# EAGLE design Termrf_v3 (EAGLE 5.11)
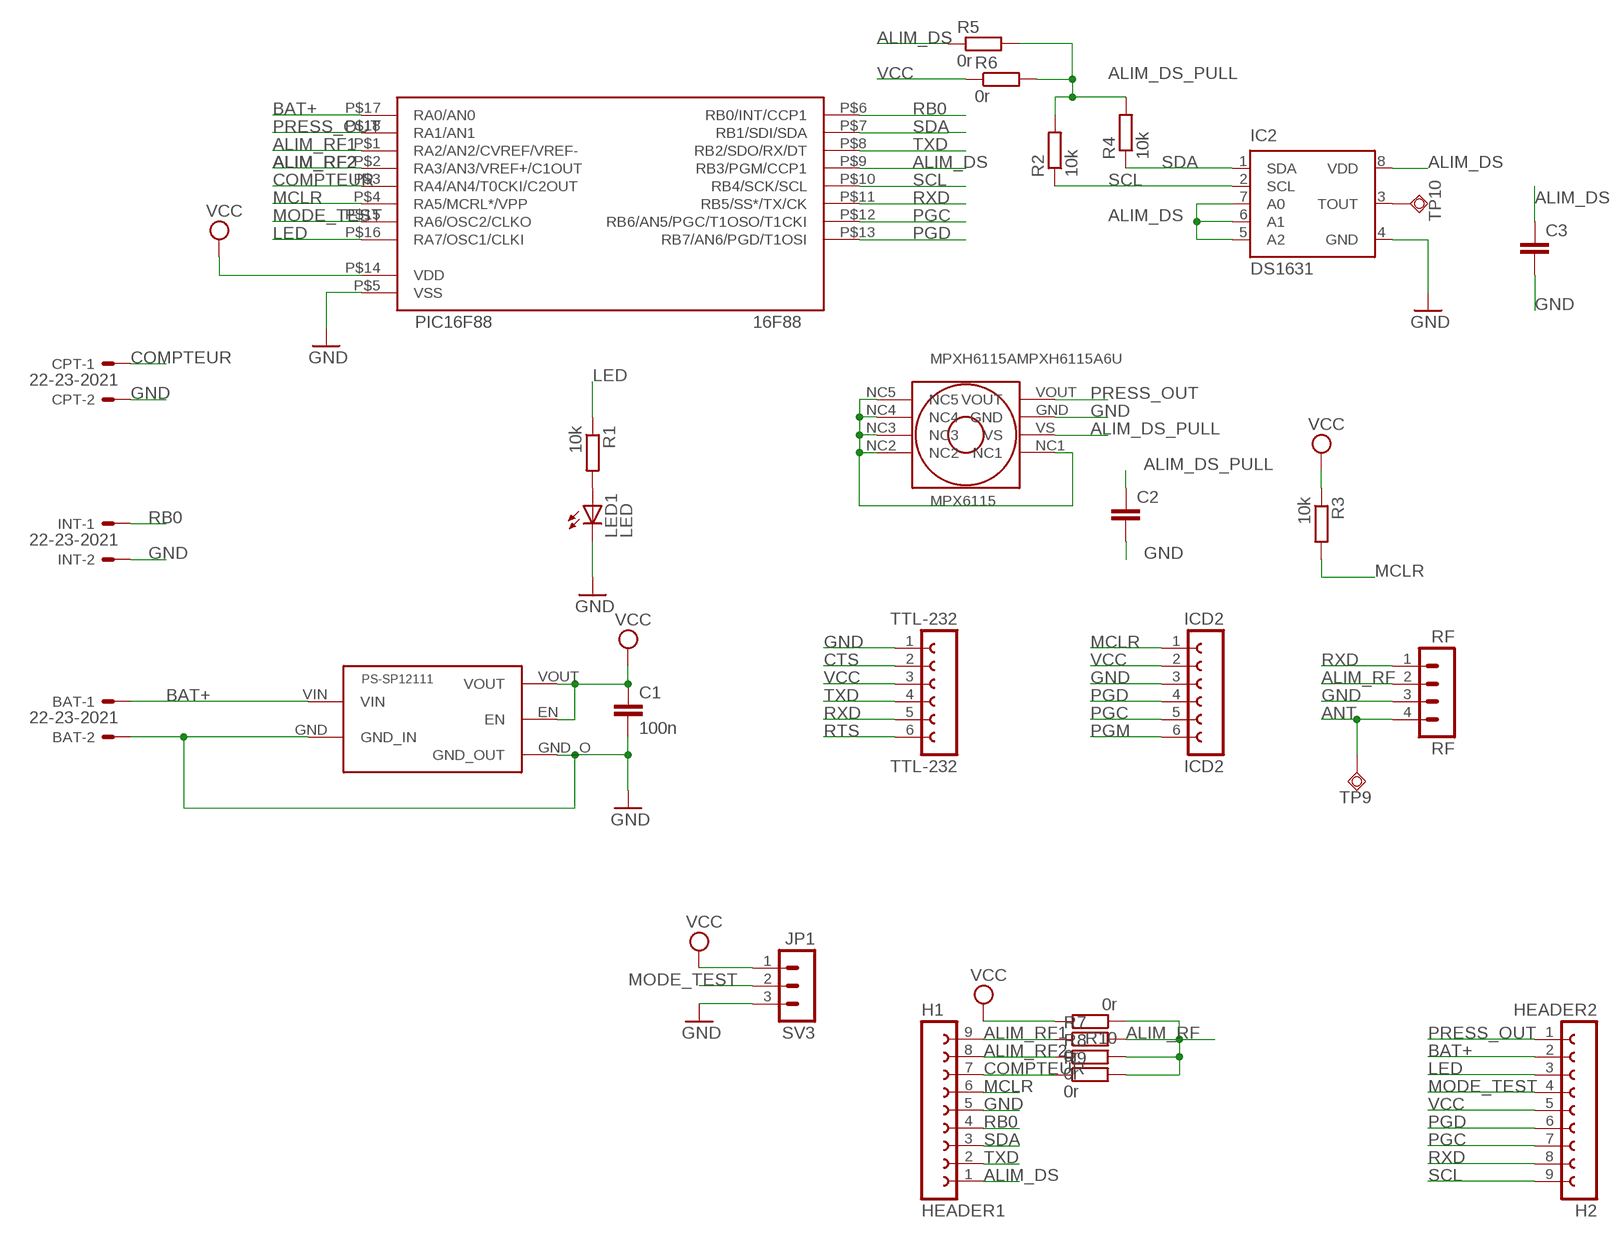
[diagram p0: schematic, sheet 1]

## Parts
16F88  PIC16F88  PIC16F88-18-SOIC  [SOIC18]
BAT  22-23-2021  [22-23-2021]
C1  100n  C-EUC0805  [C0805]
C2  C-EUC0805  [C0805]
C3  C-EUC0805  [C0805]
CPT  22-23-2021  [22-23-2021]
H1  HEADER1  FE09-1  [FE09]
H2  HEADER2  FE09-1  [FE09]
IC2  DS1631  DS1621VT  [SO08-208]
ICD2  ICD2  FE06-1  [FE06]
INT  22-23-2021  [22-23-2021]
LED1  LED  LED3MM  [LED3MM]
MPX6115  MPXH6115AMPXH6115A6U  [MPXH6115A]
R1  10k  R-EU_M0805  [M0805]
R2  10k  R-EU_M0805  [M0805]
R3  10k  R-EU_M0805  [M0805]
R4  10k  R-EU_M0805  [M0805]
R5  0r  R-EU_M0805  [M0805]
R6  0r  R-EU_M0805  [M0805]
R7  0r  R-EU_M0805  [M0805]
R8  0r  R-EU_M0805  [M0805]
R9  0r  R-EU_M0805  [M0805]
R10  0r  R-EU_M0805  [M0805]
RF  RF  MA04-1  [MA04-1]
SV3  JP1  MA03-1  [MA03-1]
TP9  TPSQPAD1-13  [P1-13]
TP10  TPSQPAD1-13  [P1-13]
TTL-232  TTL-232  FE06-1  [FE06]
U$1  PS-SP12111-BOTTOM  [PS-SP12111-BOTTOM]

## Nets
ALIM_DS: 16F88.P$9(RB3/PGM/CCP1) C3.1 H1.1 IC2.5(A2) IC2.6(A1) IC2.7(A0) IC2.8(VDD) R5.1
ALIM_DS_PULL: C2.1 MPX6115.VS R2.2 R4.2 R5.2 R6.2
ALIM_RF: R7.2 R8.2 R9.2 R10.1 RF.2
ALIM_RF1: 16F88.P$1(RA2/AN2/CVREF/VREF-) H1.9 R7.1
ALIM_RF2: 16F88.P$2(RA3/AN3/VREF+/C1OUT) H1.8 R8.1
ANT: RF.4 TP9.TP
BAT+: 16F88.P$17(RA0/AN0) BAT.1 H2.2 U$1.VIN
COMPTEUR: 16F88.P$3(RA4/AN4/T0CKI/C2OUT) CPT.1 H1.7 R9.1
CTS: TTL-232.2
GND: 16F88.P$5(VSS) BAT.2 C1.2 C2.2 C3.2 CPT.2 H1.5 IC2.4(GND) ICD2.3 INT.2 LED1.K(C) MPX6115.GND RF.3 SV3.3 TTL-232.1 U$1.GND(GND_IN) U$1.GND_O(GND_OUT)
LED: 16F88.P$16(RA7/OSC1/CLKI) H2.3 R1.1
MCLR: 16F88.P$4(RA5/MCRL*/VPP) H1.6 ICD2.1 R3.2
MODE_TEST: 16F88.P$15(RA6/OSC2/CLKO) H2.4 SV3.2
N$1: LED1.A R1.2
N$5: IC2.3(TOUT) TP10.TP
N$7: MPX6115.NC1 MPX6115.NC2 MPX6115.NC3 MPX6115.NC4 MPX6115.NC5
PGC: 16F88.P$12(RB6/AN5/PGC/T1OSO/T1CKI) H2.7 ICD2.5
PGD: 16F88.P$13(RB7/AN6/PGD/T1OSI) H2.6 ICD2.4
PGM: ICD2.6
PRESS_OUT: 16F88.P$18(RA1/AN1) H2.1 MPX6115.VOUT
RB0: 16F88.P$6(RB0/INT/CCP1) H1.4 INT.1
RTS: TTL-232.6
RXD: 16F88.P$11(RB5/SS*/TX/CK) H2.8 RF.1 TTL-232.5
SCL: 16F88.P$10(RB4/SCK/SCL) H2.9 IC2.2(SCL) R2.1
SDA: 16F88.P$7(RB1/SDI/SDA) H1.3 IC2.1(SDA) R4.1
TXD: 16F88.P$8(RB2/SDO/RX/DT) H1.2 TTL-232.4
VCC: 16F88.P$14(VDD) C1.1 H2.5 ICD2.2 R3.1 R6.1 R10.2 SV3.1 TTL-232.3 U$1.EN U$1.VOUT

## Library data of the parts
16F88 = pic16f88-v0.1:PIC16F88
BAT CPT INT = con-molex:22-23-2021: .100" (2.54mm) Center Header - 2 Pin
C1-C3 = resistor:C-EU: CAPACITOR, European symbol
H1 H2 = con-lsta:FE09-1: FEMALE HEADER
IC2 = maxim:DS1621: Digital Thermometer and Thermostat Source: http://pdfserv.maxim-ic.com/en/ds/DS1621.pdf
ICD2 TTL-232 = con-lsta:FE06-1: FEMALE HEADER
LED1 = led:LED: LED OSRAM: - CHIPLED LG R971, LG N971, LY N971, LG Q971, LY Q971, LO R971, LY R971 LH N974, LH R974 LS Q976, LO Q976, LY Q976 LO Q996 - Hyper CHIPLED LW Q18S LB Q993, LB Q99A, LB R99A - SideLED LS A670, LO A670, LY A670, LG A670, LP A670 LB A673, LV A673, LT A673, LW A673 LH A674 LY A675 LS A676, LA A676, LO A676, LY A676, LW A676 LS A679, LY A679, LG A679 - Hyper Micro SIDELED® LS Y876, LA Y876, LO Y876, LY Y876 LT Y87S - SmartLED LW L88C, LW L88S LB L89C, LB L89S, LG L890 LS L89K, LO L89K, LY L89K LS L896, LA L896, LO L896, LY L896 - TOPLED LS T670, LO T670, LY T670, LG T670, LP T670 LSG T670, LSP T670, LSY T670, LOP T670, LYG T670 LG T671, LOG T671, LSG T671 LB T673, LV T673, LT T673, LW T673 LH T674 LS T676, LA T676, LO T676, LY T676, LB T676, LH T676, LSB T676, LW T676 LB T67C, LV T67C, LT T67C, LS T67K, LO T67K, LY T67K, LW E67C LS E67B, LA E67B, LO E67B, LY E67B, LB E67C, LV E67C, LT E67C LW T67C LS T679, LY T679, LG T679 LS T770, LO T770, LY T770, LG T770, LP T770 LB T773, LV T773, LT T773, LW T773 LH T774 LS E675, LA E675, LY E675, LS T675 LS T776, LA T776, LO T776, LY T776, LB T776 LHGB T686 LT T68C, LB T68C - Hyper Mini TOPLED® LB M676 - Mini TOPLED Santana® LG M470 LS M47K, LO M47K, LY M47K Source: http://www.osram.convergy.de LUXEON: - LUMILED® LXK2-PW12-R00, LXK2-PW12-S00, LXK2-PW14-U00, LXK2-PW14-V00 LXK2-PM12-R00, LXK2-PM12-S00, LXK2-PM14-U00 LXK2-PE12-Q00, LXK2-PE12-R00, LXK2-PE12-S00, LXK2-PE14-T00, LXK2-PE14-U00 LXK2-PB12-K00, LXK2-PB12-L00, LXK2-PB12-M00, LXK2-PB14-N00, LXK2-PB14-P00, LXK2-PB14-Q00 LXK2-PR12-L00, LXK2-PR12-M00, LXK2-PR14-Q00, LXK2-PR14-R00 LXK2-PD12-Q00, LXK2-PD12-R00, LXK2-PD12-S00 LXK2-PH12-R00, LXK2-PH12-S00 LXK2-PL12-P00, LXK2-PL12-Q00, LXK2-PL12-R00 Source: www.luxeon.com KINGBRIGHT: KA-3528ASYC Source: www.kingbright.com
MPX6115 = freescale_custom:MPXH6115A: High Temperature Accuracy Integrated Silicon Pressure Sensor for Measuring Absolute Pressure, On-Chip Signal Conditioned, Temperature Compensated and Calibrated
R1-R10 = resistor:R-EU_: RESISTOR, European symbol
RF = con-lstb:MA04-1: PIN HEADER
SV3 = con-lstb:MA03-1: PIN HEADER
TP9 TP10 = testpad:TPSQ: Test pad
U$1 = sure:PS-SP12111

## Board
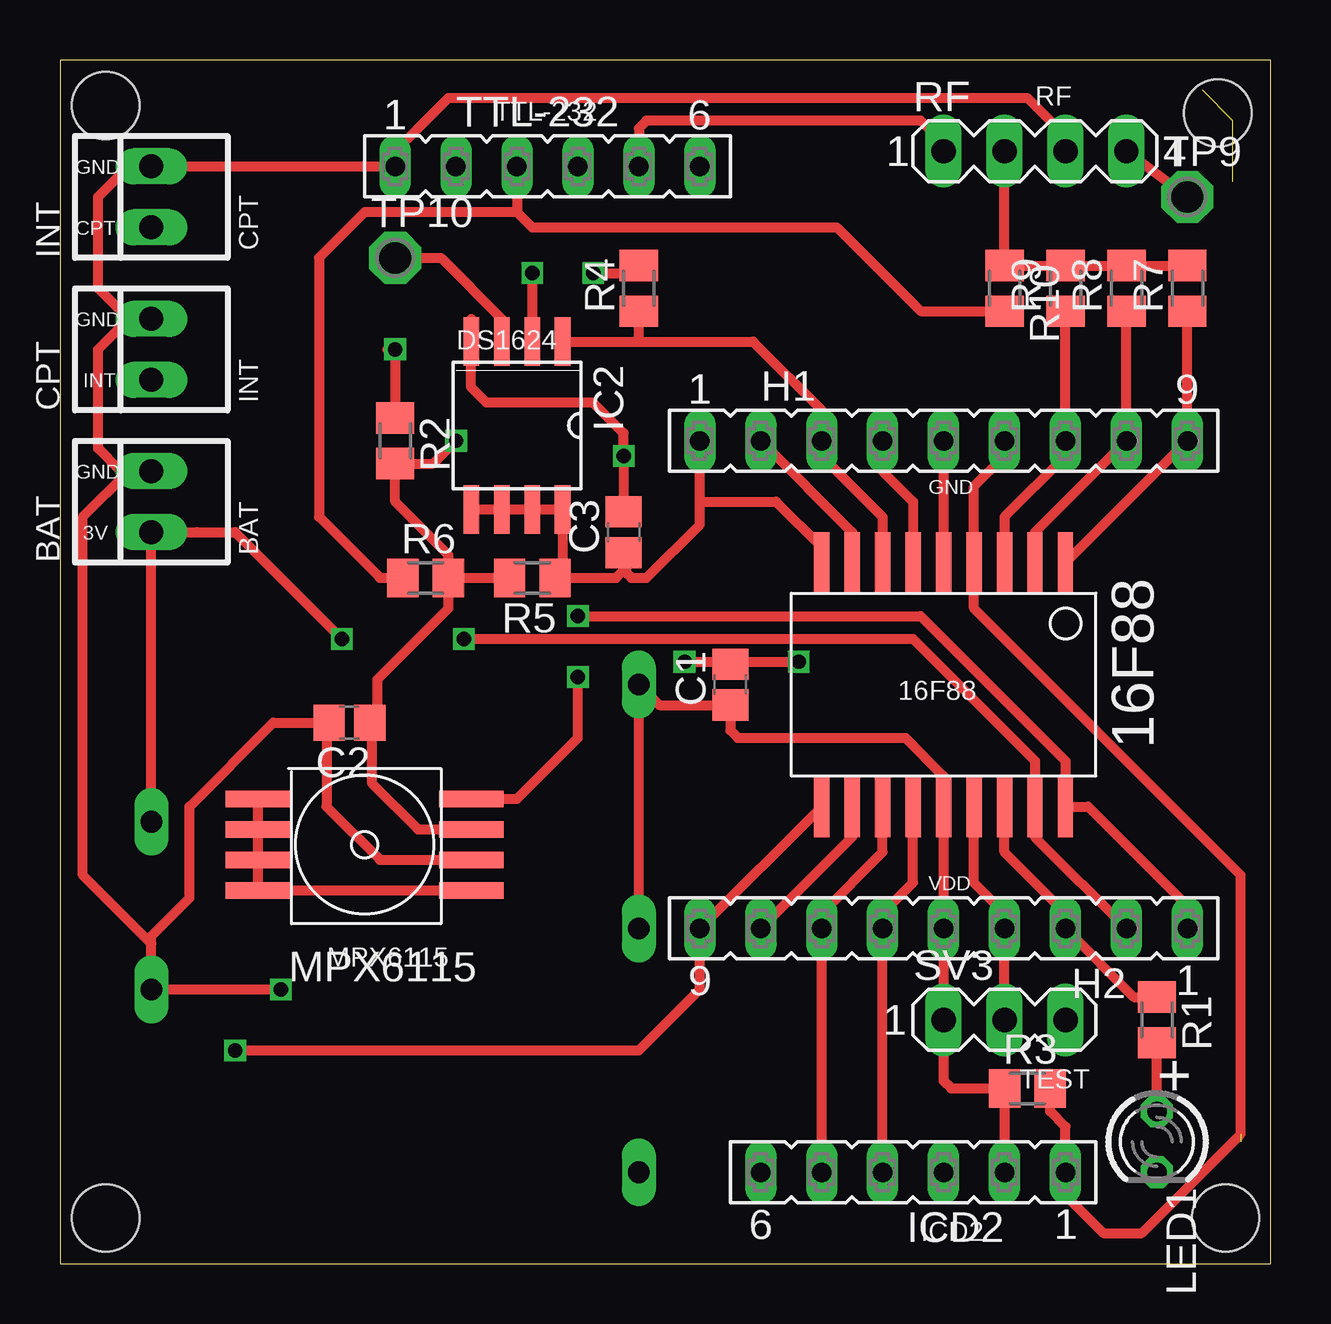
[diagram p1: board, top side]
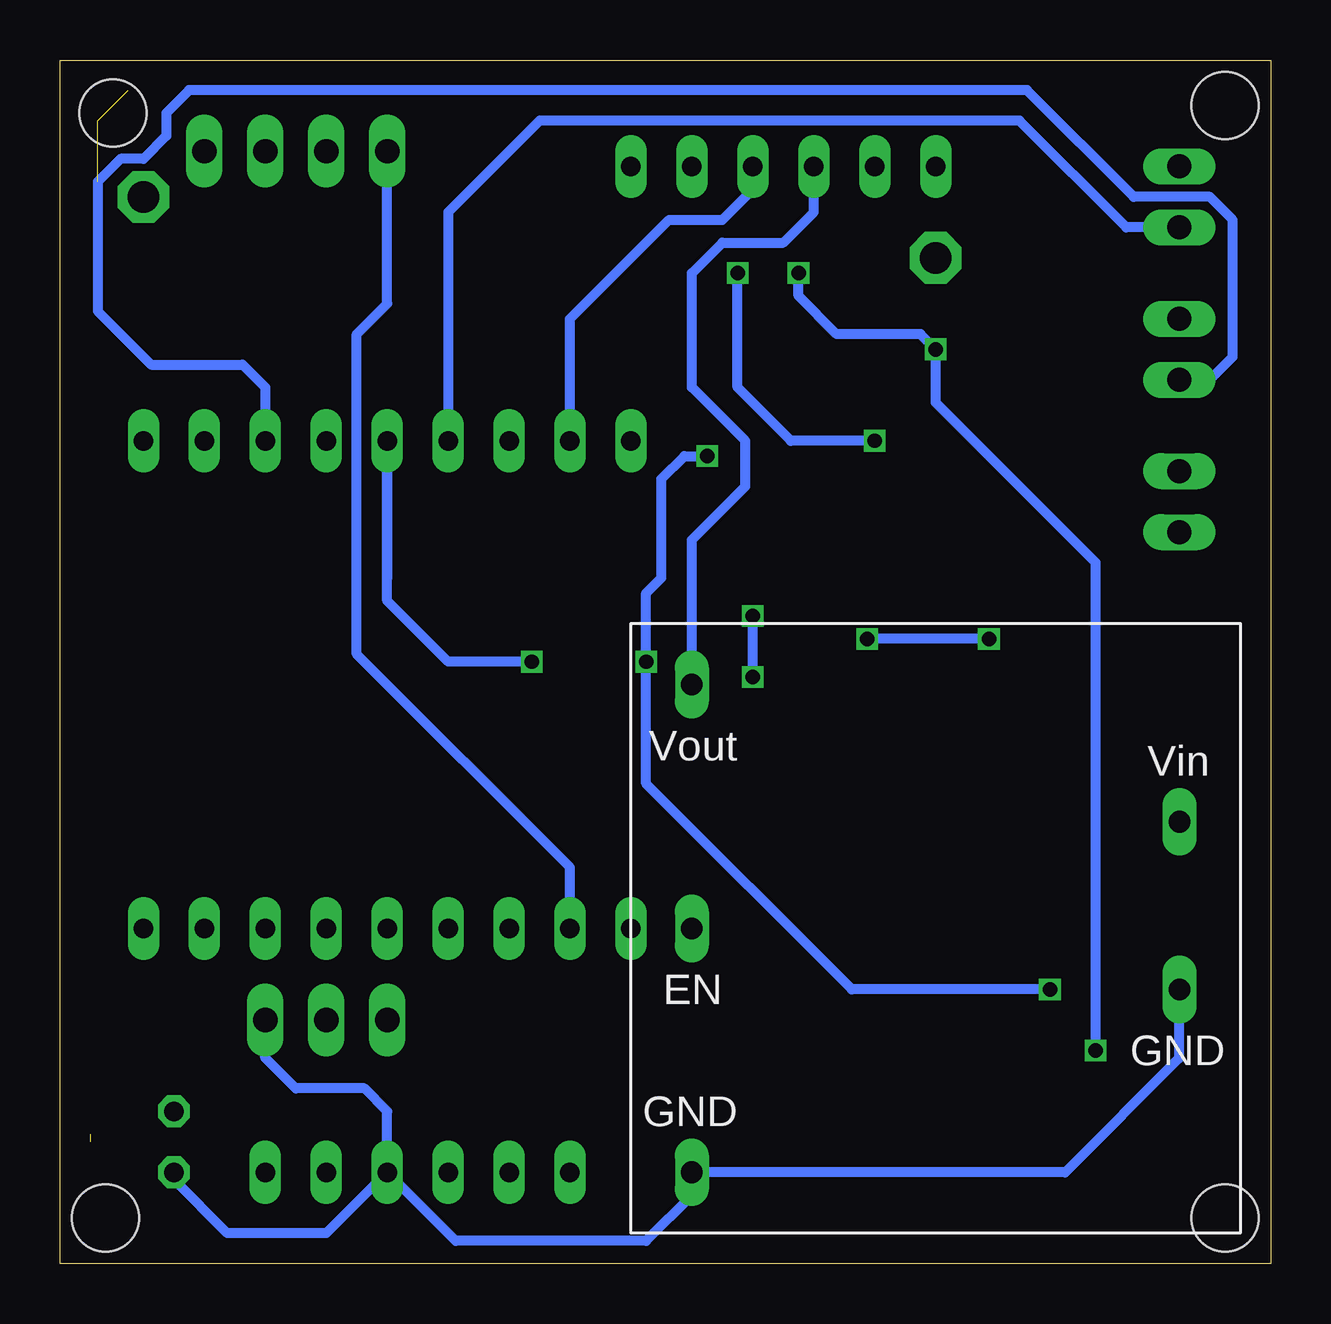
[diagram p2: board, bottom side, seen from below]

Size 50.47 x 50.16 mm. Coordinates in mm from the lower left corner, seen from the top.
Outline: 0,0 50.47,0 50.47,50.16 0,50.16 0,0
Copper layers (1*16): Top 0.035mm / dielectric 1.5mm / Bottom 0.035mm
Design rules "Fusion_eagle_rule_v1.1": minimum track width 6mil, minimum drill 12mil, track to track 6mil, track to pad 6mil, pad to pad 6mil, via to via 6mil, smd to smd 0mil, copper to edge 10mil, drill to drill 10mil, minimum pad ring 10mil, minimum via ring 6mil, stop-mask expansion 2mil, vias tented up to drill 100mil, thermal gap 10mil
Holes 2.8 mm at 1.91,48.26 1.91,1.91 48.58,1.91 48.26,47.94

### Footprints (pad centres in the part's own frame; a part is rotated, then mirrored left to right if it is on the bottom)
SOIC18 = smd 0.635 x 2.54: P$1 -5.08,-5.08; P$2 -3.81,-5.08; P$3 -2.54,-5.08; P$4 -1.27,-5.08; P$5 0,-5.08; P$6 1.27,-5.08; P$7 2.54,-5.08; P$8 3.81,-5.08; P$9 5.08,-5.08; P$10 5.08,5.08; P$11 3.81,5.08; P$12 2.54,5.08; P$13 1.27,5.08; P$14 0,5.08; P$15 -1.27,5.08; P$16 -2.54,5.08; P$17 -3.81,5.08; P$18 -5.08,5.08
22-23-2021 = drill 1 long: 1 -1.27,0; 2 1.27,0
C0805 = smd 1.3 x 1.5: 1 -0.85,0; 2 0.85,0
FE09 = drill 0.813 long: 1 -10.16,0; 2 -7.62,0; 3 -5.08,0; 4 -2.54,0; 5 0,0; 6 2.54,0; 7 5.08,0; 8 7.62,0; 9 10.16,0
SO08-208 = smd 0.66 x 2.032: 1 -1.905,-3.498; 2 -0.635,-3.498; 3 0.635,-3.498; 4 1.905,-3.498; 5 1.905,3.498; 6 0.635,3.498; 7 -0.635,3.498; 8 -1.905,3.498
FE06 = drill 0.813 long: 1 -6.35,0; 2 -3.81,0; 3 -1.27,0; 4 1.27,0; 5 3.81,0; 6 6.35,0
LED3MM = drill 0.813 octagon: A -1.27,0; K 1.27,0
MPXH6115A = smd 2.7 x 0.69: GND 8.89,-2.54; NC1 8.89,-3.81; NC2 0,-3.81; NC3 0,-2.54; NC4 0,-1.27; NC5 0,0; VOUT 8.89,0; VS 8.89,-1.27
M0805 = smd 1.3 x 1.6: 1 -0.95,0; 2 0.95,0
MA04-1 = drill 1.016 long: 1 -3.81,0; 2 -1.27,0; 3 1.27,0; 4 3.81,0
MA03-1 = drill 1.016 long: 1 -2.54,0; 2 0,0; 3 2.54,0
P1-13 = drill 1.321 pad 2.159 octagon: TP 0,0
PS-SP12111-BOTTOM = drill 0.9 long: EN -10.16,0; GND 10.16,2.54; GND_O -10.16,10.16; VIN 10.16,-4.445; VOUT -10.16,-10.16

### Placement (x,y rotation side)
16F88  36.83,24.13 180 top
BAT  3.81,31.75 90 top
C1  27.94,24.13 90 top
C2  12.06,22.54 180 top
C3  23.5,30.48 90 top
CPT  3.81,38.1 90 top
H1  36.83,34.29 0 top
H2  36.83,13.97 180 top
IC2  19.05,34.92 180 top
ICD2  35.56,3.81 180 top
INT  3.81,44.45 90 top
LED1  45.72,5.08 270 top
MPX6115  8.26,19.37 0 top
R1  45.72,10.16 270 top
R2  13.97,34.29 270 top
R3  40.32,7.3 0 top
R4  24.13,40.64 90 top
R5  19.68,28.57 180 top
R6  15.24,28.57 0 top
R7  46.99,40.64 90 top
R8  44.45,40.64 90 top
R9  41.91,40.64 90 top
R10  39.37,40.64 270 top
RF  40.64,46.35 0 top
SV3  39.37,10.16 0 top
TP9  46.99,44.45 0 top
TP10  13.97,41.91 0 top
TTL-232  20.32,45.72 0 top
U$1  13.97,13.97 180 top

### Tracks (layer width: path | path; a pad name or v marks a point on that pad's centre or on a via)
ALIM_DS
  Top 0.406: IC2.5 IC2.6 IC2.7 IC2.8 | IC2.8 20.95,28.57 R5.1 23.18,28.57 23.5,28.89 C3.1 23.6,29.53 23.6,28.79 23.81,28.57 24.45,28.57 26.67,30.8 26.67,31.75 | 26.67,31.75 H1.1 | 16F88.P$9 31.75,29.84 29.84,31.75 26.67,31.75 | IC2.8
ALIM_DS_PULL  (via drill 0.6)
  Top 0.406: R6.2 R5.2 | R6.2 15.88,28.89 | R6.2 16.19,27.3 13.23,24.35 13.23,22.86 C2.1 13.02,22.44 13.02,20 14.92,18.1 MPX6115.VS | R6.2 16.19,29.53 13.97,31.75 R2.2 13.97,33.02 14.29,33.34 15.56,33.34 v16.51,34.29 | v22.23,41.27 23.82,41.27 R4.2
  Bottom 0.406: v16.51,34.29 20,34.29 22.23,36.51 v22.23,41.27
ALIM_RF
  Top 0.406: R7.2 R8.2 R9.2 R10.1 RF.2
ALIM_RF1
  Top 0.406: 16F88.P$1 H1.9 R7.1
ALIM_RF2
  Top 0.406: 16F88.P$2 40.64,30.48 H1.8 R8.1
ANT
  Top 0.406: TP9.TP RF.4
BAT+  (via drill 0.6)
  Top 0.406: H2.2 40.64,17.78 16F88.P$17 40.64,20.95 35.56,26.04 v16.83,26.04 | U$1.VIN BAT.1 | BAT.1 5.71,30.48 | BAT.1 7.3,30.48 v11.75,26.04
  Bottom 0.406: v11.75,26.04 v16.83,26.04
COMPTEUR  (2 unrouted)
  Top 0.406: R9.1 H1.7 41.91,33.66 39.37,31.11 16F88.P$3
  Bottom 0.406: CPT.1 2.54,36.83 1.59,37.78 1.59,43.5 2.54,44.45 5.71,44.45 10.16,48.9 45.09,48.9 46.04,47.94 46.04,46.99 46.99,46.04 47.94,46.04 48.9,45.09 48.9,39.69 46.67,37.47 42.86,37.47 41.91,36.51 H1.7
GND  (via drill 0.6)
  Top 0.406: H1.5 16F88.P$5 | MPX6115.GND 13.34,16.83 11.11,19.05 11.11,22.44 C2.2 8.89,22.54 5.4,19.05 5.4,15.24 3.81,13.65 3.81,13.34 | 23.5,31.43 C3.2 v23.5,33.66 23.5,34.61 22.23,35.88 17.78,35.88 17.14,36.51 IC2.4 17.14,39.37 | 2.86,39.37 1.59,40.64 1.59,44.45 2.86,45.72 INT.2 TTL-232.1 13.97,46.35 16.19,48.58 40.32,48.58 41.91,46.99 RF.3 | 2.86,39.37 CPT.2 | 2.86,39.37 1.59,38.1 1.59,33.97 2.54,33.02 BAT.2 2.86,33.02 0.95,31.11 0.95,16.19 3.81,13.34 | v30.8,25.08 28.04,25.08 C1.2 27.84,25.08 v26.04,25.08 | 3.81,13.34 U$1.GND v9.21,11.43
  Bottom 0.406: LED1.K 45.72,3.49 43.5,1.27 39.37,1.27 ICD2.3 | SV3.3 41.91,8.57 40.64,7.3 37.78,7.3 36.83,6.35 ICD2.3 | v23.5,33.66 24.45,33.66 25.4,32.7 25.4,28.57 26.04,27.94 v26.04,25.08 26.04,20 17.46,11.43 v9.21,11.43 | 36.83,28.57 H1.5 36.83,27.62 34.29,25.08 v30.8,25.08 | ICD2.3 33.97,0.95 26.04,0.95 24.13,2.86 U$1.GND_O 8.57,3.81 3.81,8.57 U$1.GND
LED
  Top 0.406: 16F88.P$16 39.37,17.14 41.91,14.61 H2.3 44.77,11.11 R1.1
MCLR  (1 unrouted)
  Top 0.406: H1.6 39.37,33.66 38.1,32.38 16F88.P$4 38.1,27.3 49.21,16.19 49.21,5.4 45.09,1.27 43.5,1.27 41.91,2.86 ICD2.1 41.91,5.71 41.27,6.35 R3.2
MODE_TEST
  Top 0.406: 16F88.P$15 38.1,15.88 39.37,14.61 H2.4 SV3.2
N$1
  Top 0.406: LED1.A R1.2
N$5
  Top 0.406: IC2.3 18.41,39.37 15.88,41.91 TP10.TP
N$7
  Top 0.406: MPX6115.NC1 MPX6115.NC2 MPX6115.NC3 MPX6115.NC4 MPX6115.NC5
PGC
  Top 0.406: 16F88.P$12 34.29,17.14 31.75,14.61 H2.7 ICD2.5
PGD
  Top 0.406: 16F88.P$13 35.56,15.88 34.29,14.61 H2.6 ICD2.4
PRESS_OUT  (via drill 0.6)
  Top 0.406: H2.1 46.99,14.92 42.86,19.05 16F88.P$18 41.91,20.95 35.88,26.99 v21.59,26.99 | MPX6115.VOUT 19.05,19.37 21.59,21.91 v21.59,24.45
  Bottom 0.406: v21.59,24.45 v21.59,26.99
RB0
  Top 0.406: 16F88.P$6 35.56,31.75 34.29,33.02 H1.4
  Bottom 0.406: H1.4 34.29,43.81 30.48,47.62 10.48,47.62 6.03,43.18 INT.1
RXD
  Top 0.406: 16F88.P$11 33.02,17.78 H2.8 | 24.13,46.67 TTL-232.5 24.13,47.31 24.45,47.62 35.88,47.62 36.83,46.67 RF.1
  Bottom 0.406: H2.8 29.21,16.51 38.1,25.4 38.1,38.73 36.83,40.01 RF.1
SCL  (via drill 0.6)
  Top 0.406: 16F88.P$10 H2.9 26.67,11.43 24.13,8.89 v7.3,8.89 | R2.1 v13.97,38.1 13.65,38.1 | v19.68,41.27 IC2.2
  Bottom 0.406: v7.3,8.89 7.3,29.21 13.97,35.88 v13.97,38.1 14.61,38.73 18.1,38.73 19.68,40.32 v19.68,41.27
SDA
  Top 0.406: IC2.1 24.13,38.42 | 16F88.P$7 34.29,31.11 31.75,33.66 H1.3 31.75,35.56 28.89,38.42 24.14,38.42 24.13,38.42 | 24.13,38.42 R4.1
TXD
  Top 0.406: 16F88.P$8 33.02,30.48 H1.2
  Bottom 0.406: H1.2 29.21,39.37 25.08,43.5 22.86,43.5 21.59,44.77 TTL-232.4
VCC
  Top 0.406: R10.2 35.88,39.69 32.38,43.18 19.68,43.18 19.05,43.81 | TTL-232.3 19.05,43.81 | 39.37,3.17 ICD2.2 R3.1 37.15,7.3 36.83,7.62 SV3.1 H2.5 16F88.P$14 36.83,20.32 35.24,21.91 28.26,21.91 27.94,22.23 C1.1 24.98,23.28 U$1.VOUT U$1.EN | R6.1 13.34,28.57 10.79,31.11 10.79,41.91 12.7,43.81 19.05,43.81
  Bottom 0.406: U$1.VOUT 24.13,30.16 21.91,32.38 21.91,34.29 24.13,36.51 24.13,41.27 22.86,42.55 20.32,42.55 19.05,43.81 TTL-232.3

### Text on the board
tPlace: TTL-232 | RF | GND | CPT | CPT | GND | DS1624 | INT | INT | GND | GND | 3V | BAT | 16F88 | VDD | MPX6115 | TEST | + | ICD2